# EAGLE schematic rizon-smd (EAGLE 8.4.1)
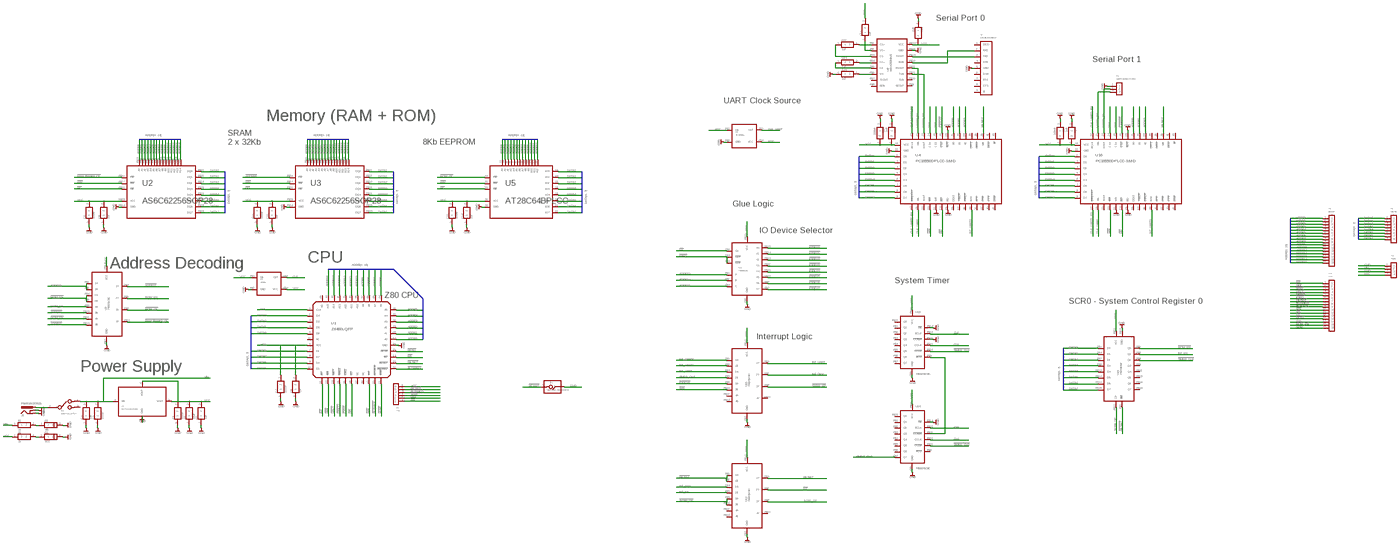
[diagram p0: schematic, sheet 1, overview]
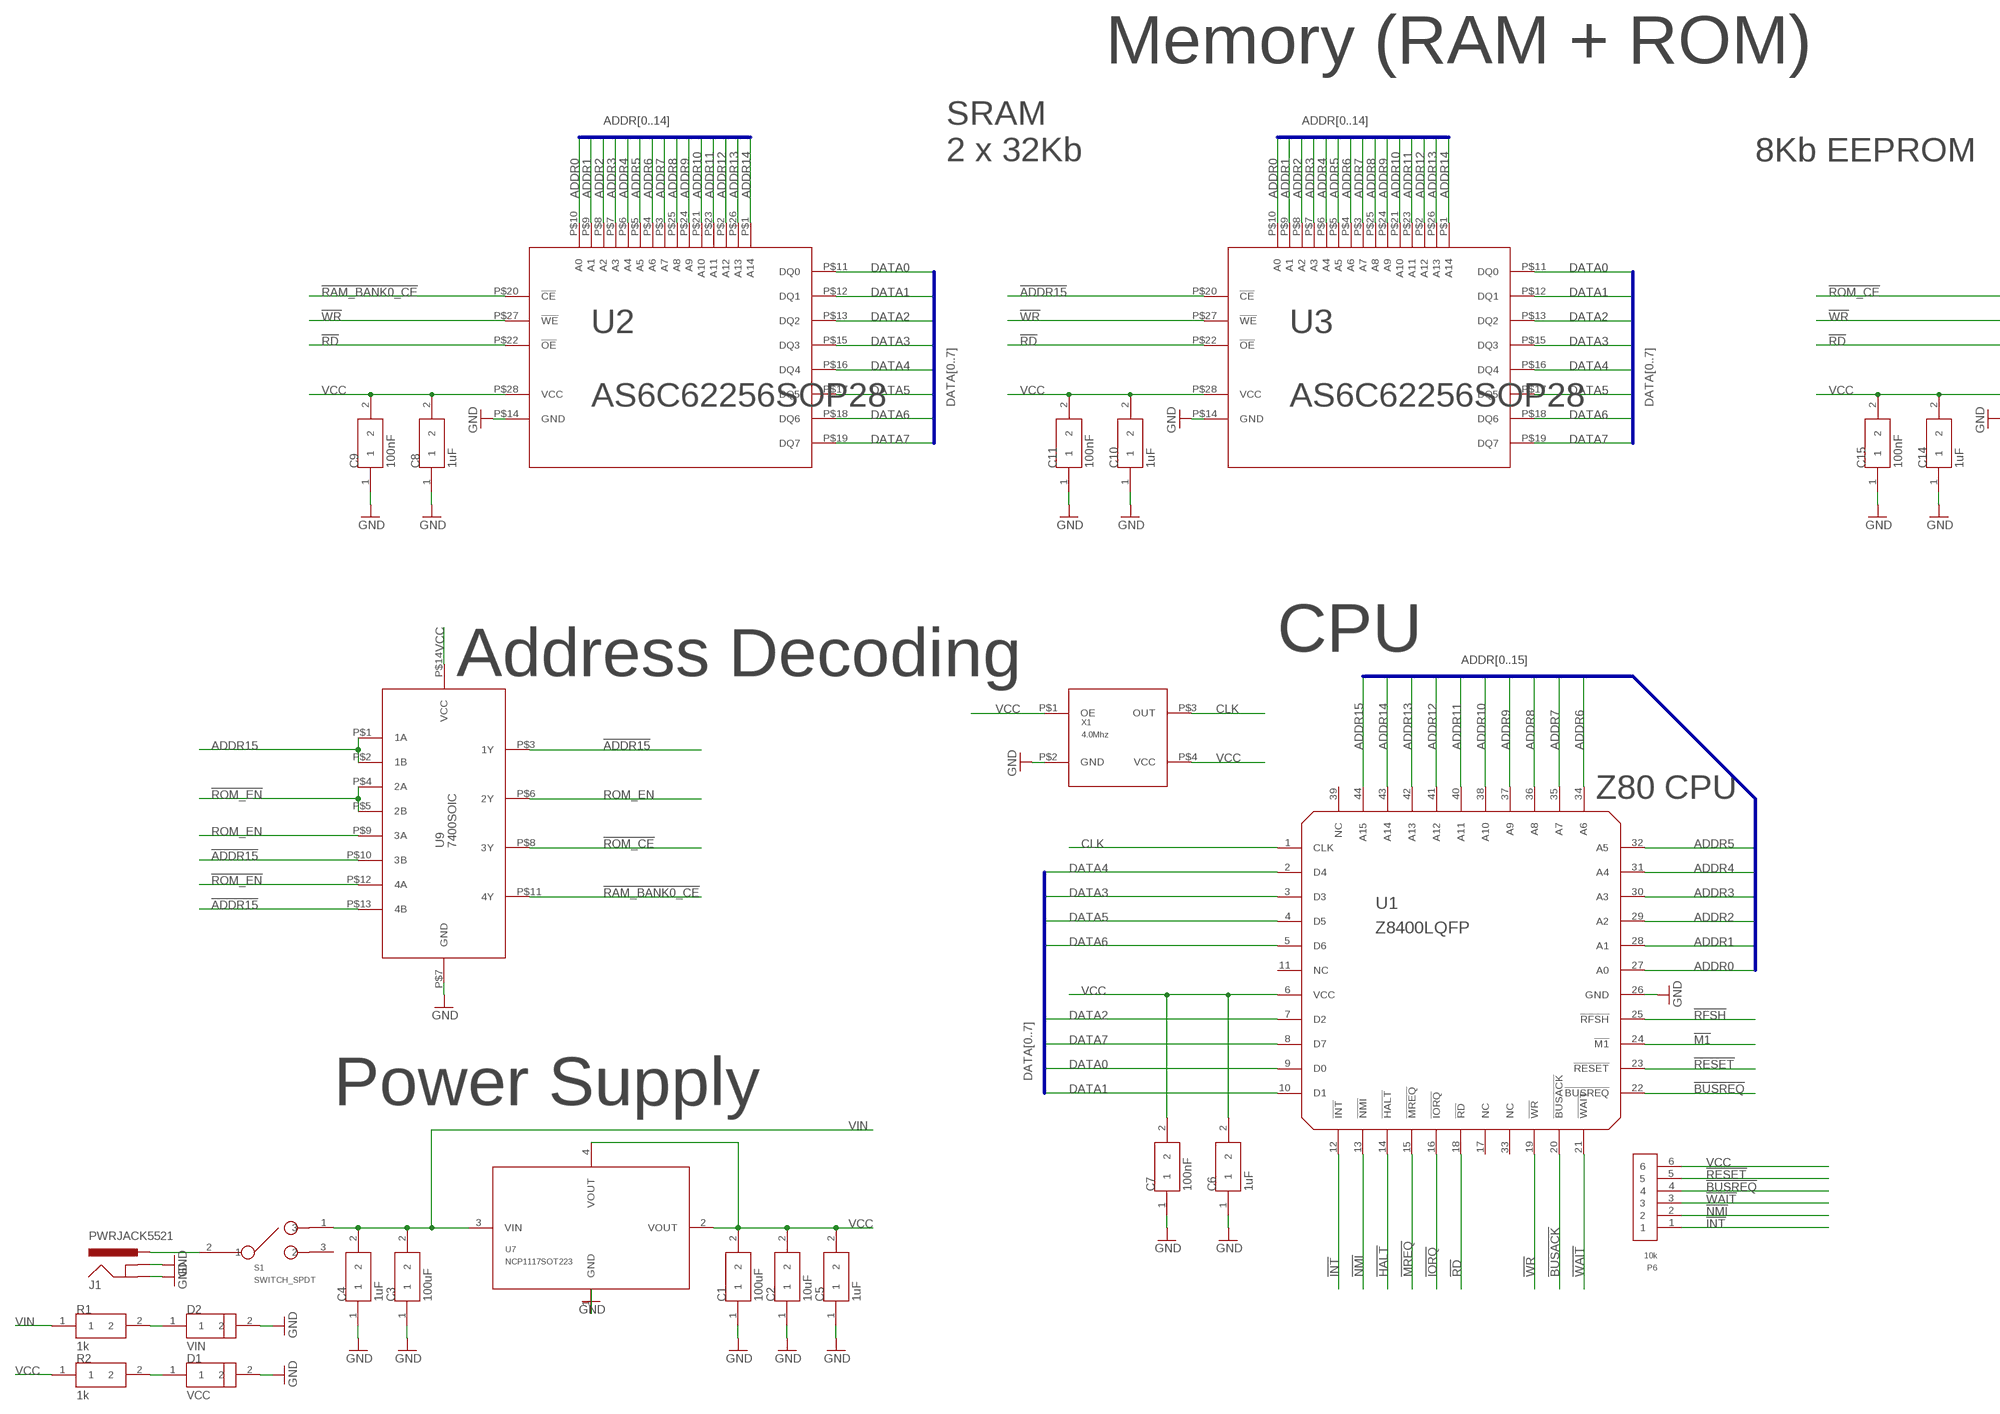
[diagram p1: schematic, sheet 1, part 1 of 4]
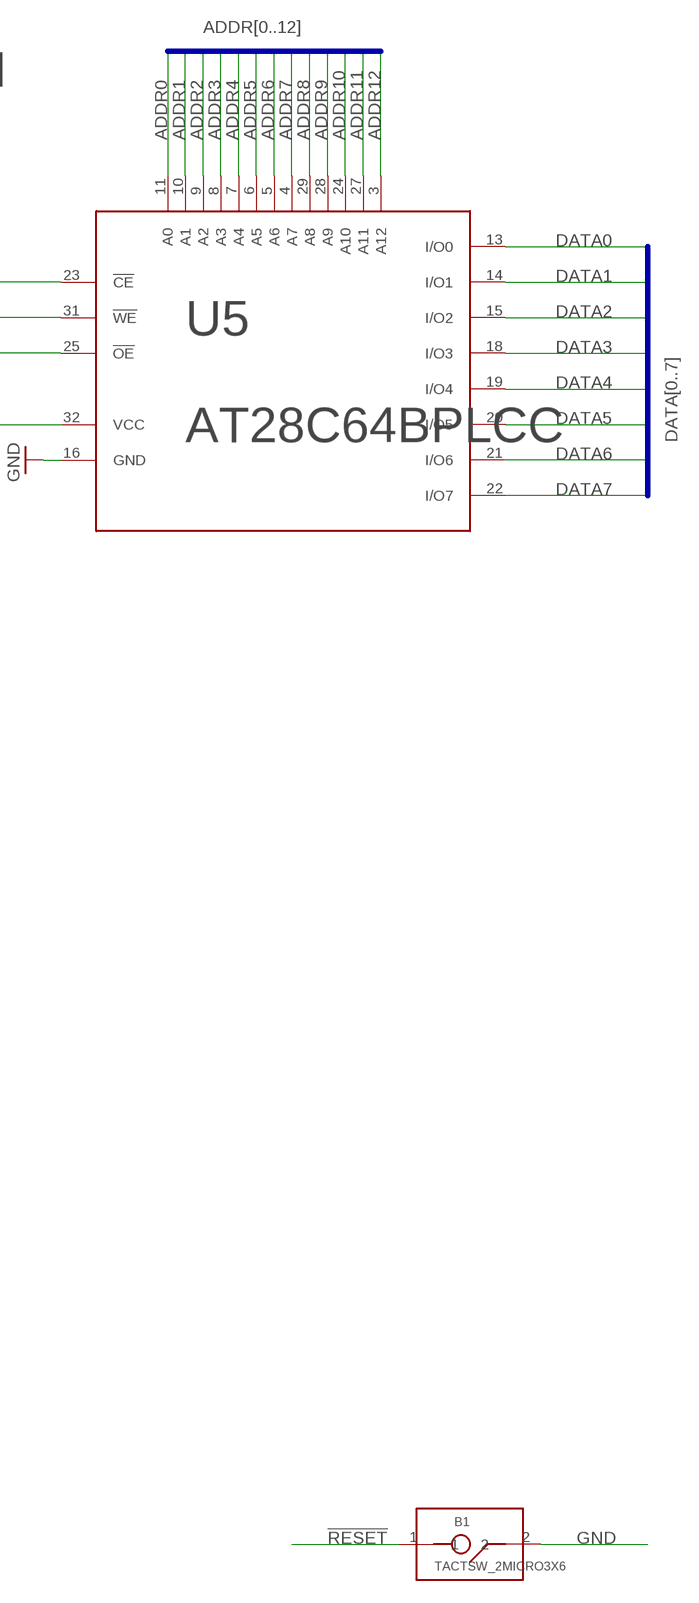
[diagram p2: schematic, sheet 1, part 2 of 4]
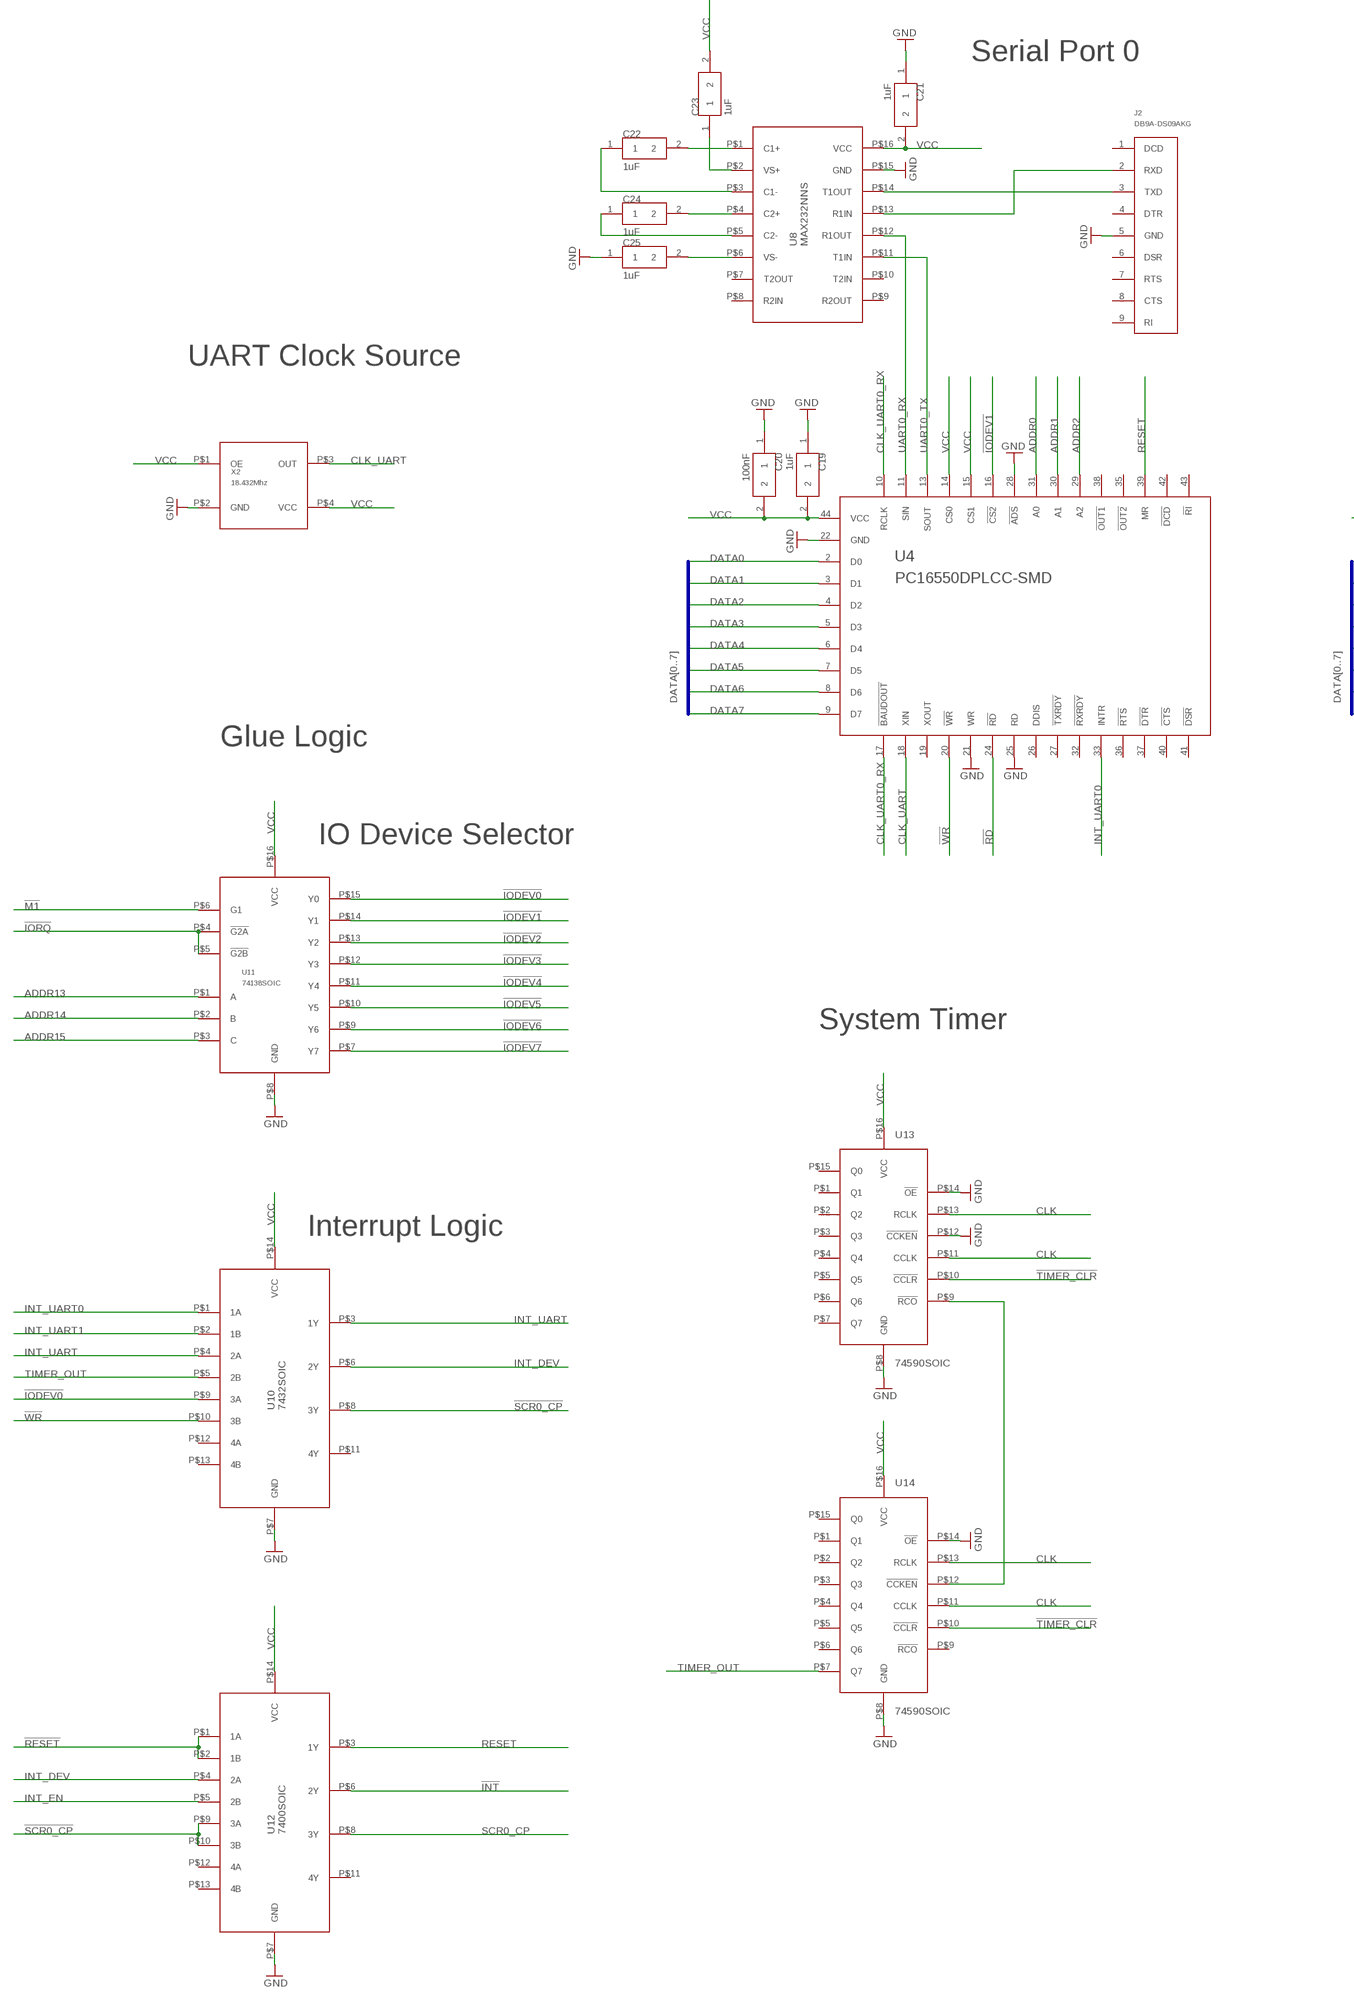
[diagram p3: schematic, sheet 1, part 3 of 4]
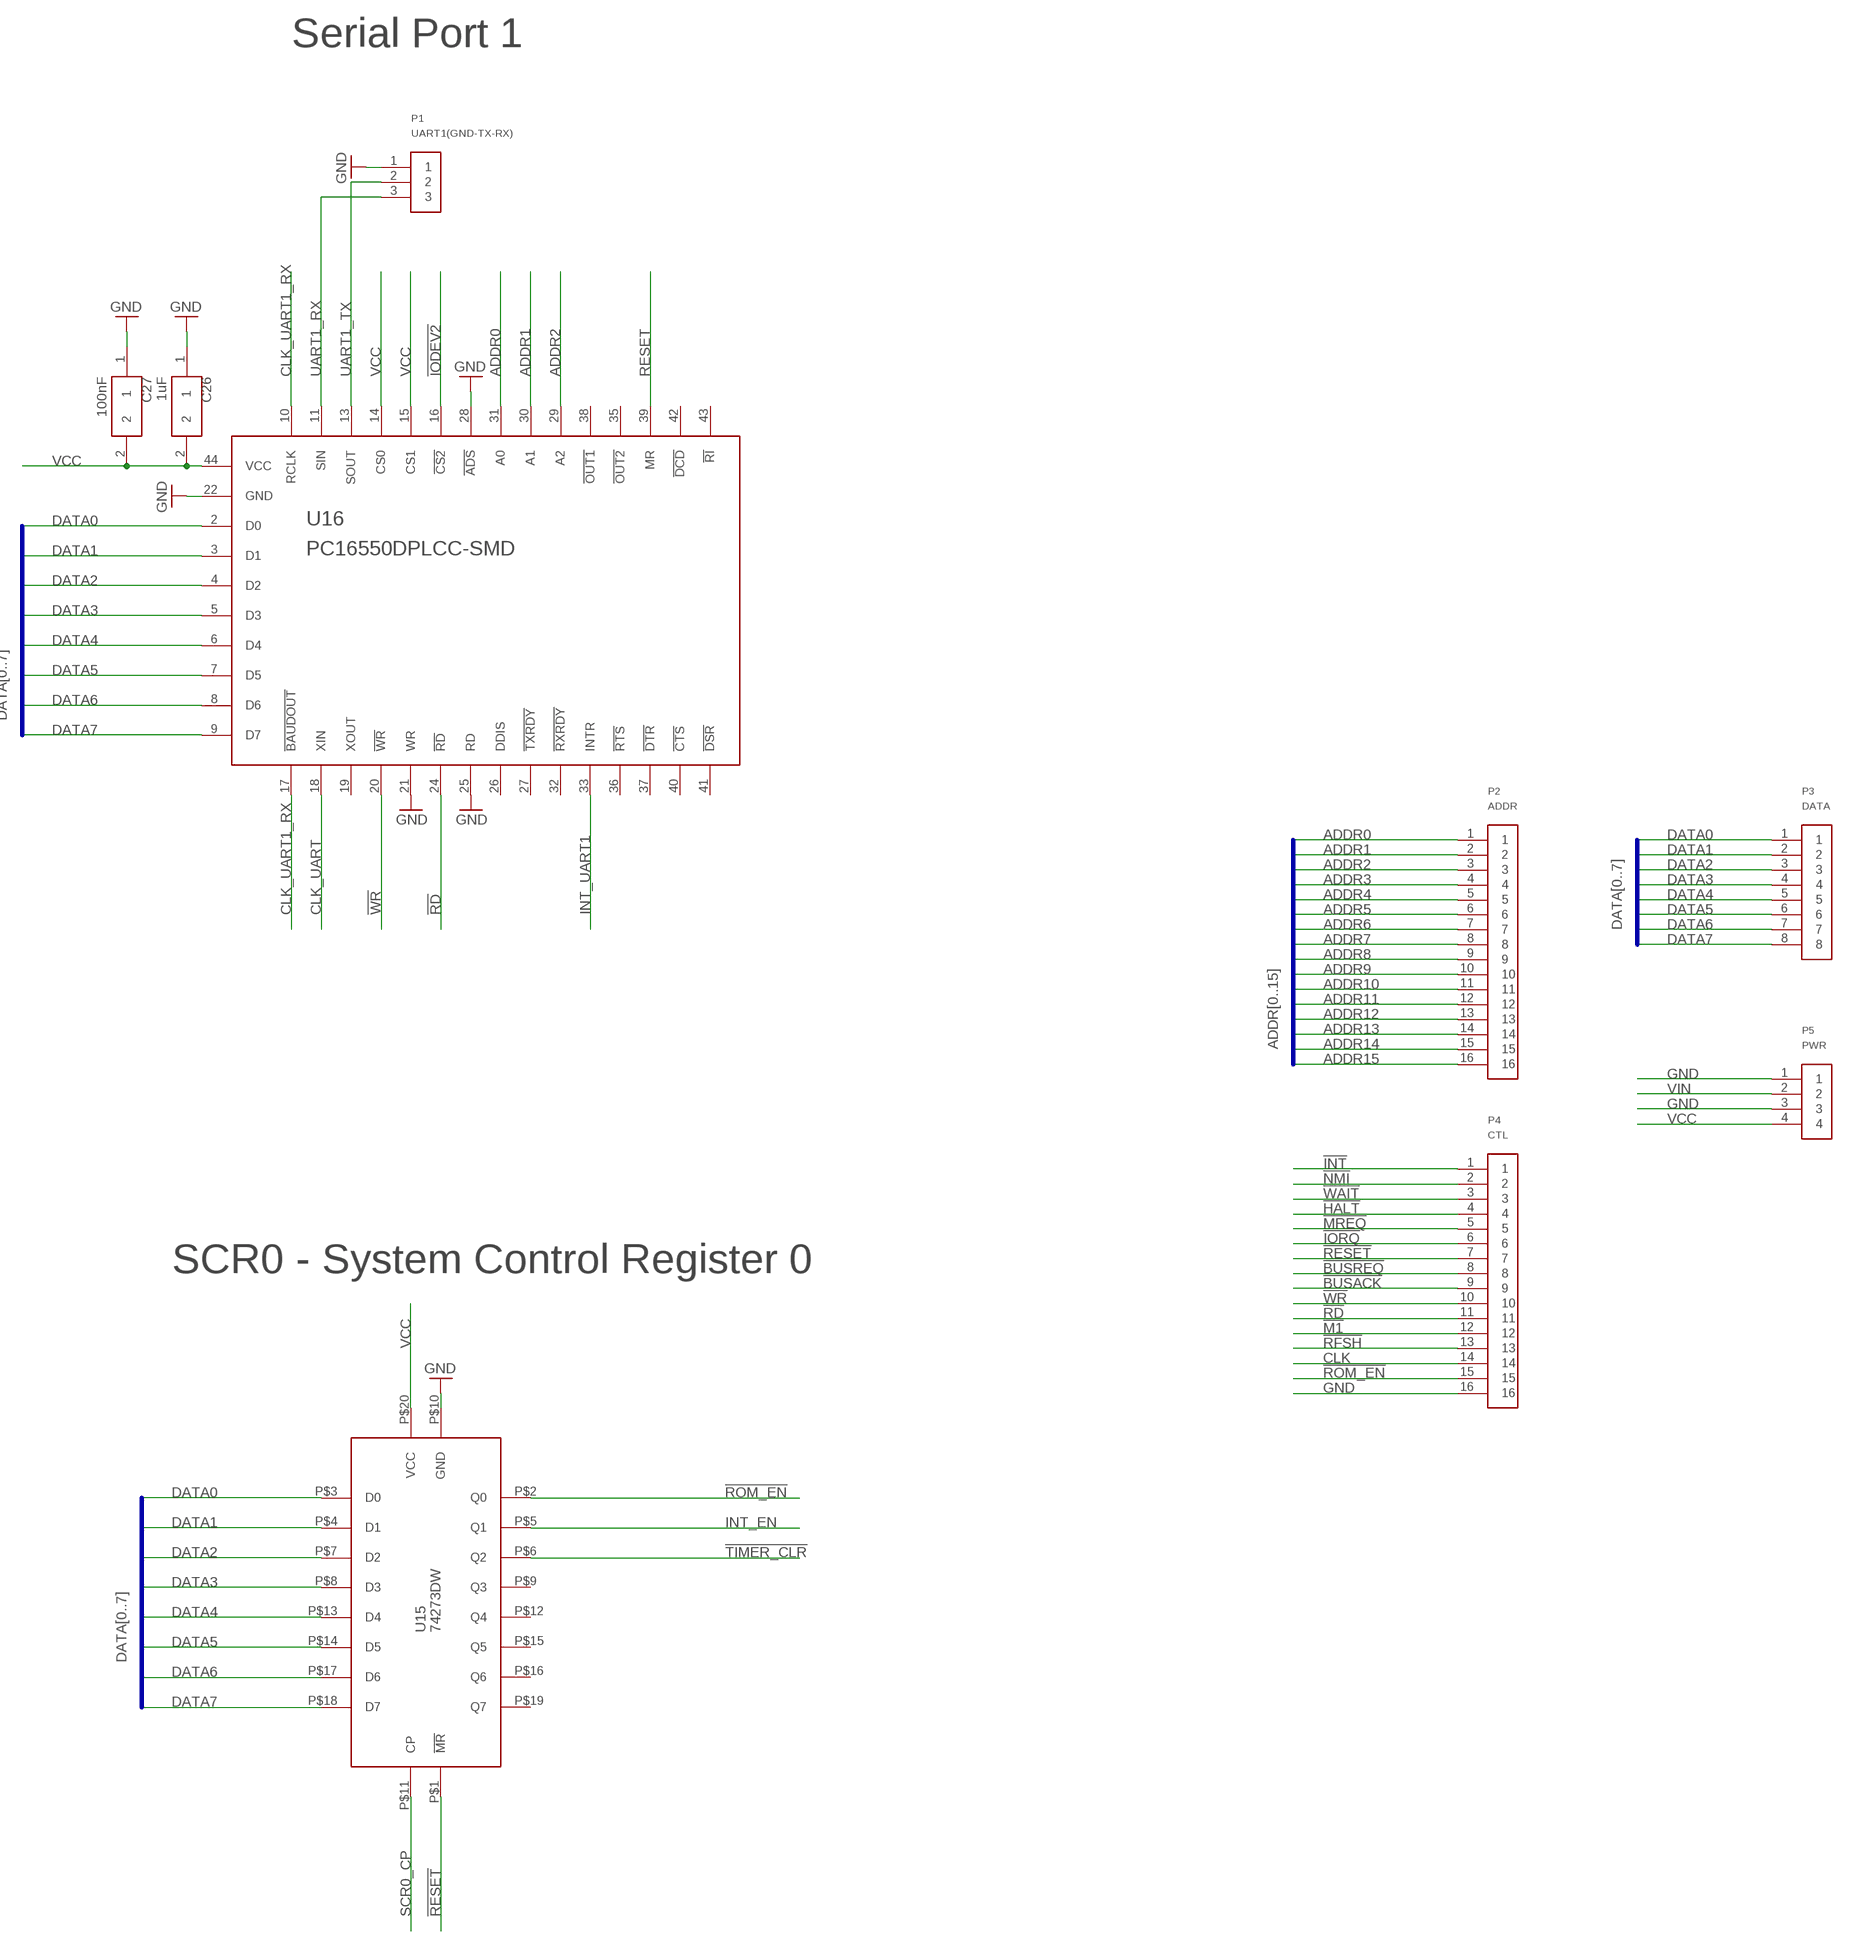
[diagram p4: schematic, sheet 1, part 4 of 4]

## Parts
B1  TACTSW_2MICRO3X6  [TACTSW_MICRO3X6]
C1  100uF  CAP1210  [1210]
C2  10uF  CAP0805  [0805]
C3  100uF  CAP1210  [1210]
C4  1uF  CAP0805  [0805]
C5  1uF  CAP0805  [0805]
C6  1uF  CAP0805  [0805]
C7  100nF  CAP0805  [0805]
C8  1uF  CAP0805  [0805]
C9  100nF  CAP0805  [0805]
C10  1uF  CAP0805  [0805]
C11  100nF  CAP0805  [0805]
C14  1uF  CAP0805  [0805]
C15  100nF  CAP0805  [0805]
C19  1uF  CAP0805  [0805]
C20  100nF  CAP0805  [0805]
C21  1uF  CAP0805  [0805]
C22  1uF  CAP0805  [0805]
C23  1uF  CAP0805  [0805]
C24  1uF  CAP0805  [0805]
C25  1uF  CAP0805  [0805]
C26  1uF  CAP0805  [0805]
C27  100nF  CAP0805  [0805]
D1  VCC  LED0805  [0805]
D2  VIN  LED0805  [0805]
J1  PWRJACK5521  [PWRJACK_5521]
J2  DB9A-DS09AKG  [A-DS09AKG]
P1  UART1(GND-TX-RX)  PIN_3  [PIN_3]
P2  ADDR  PIN_16  [PIN_16]
P3  DATA  PIN_8  [PIN_8]
P4  CTL  PIN_16  [PIN_16]
P5  PWR  PIN_4  [PIN_4]
P6  10k  PIN_61LINE  [PIN_6]
R1  1k  RES0805  [0805]
R2  1k  RES0805  [0805]
S1  SWITCH_SPDT  [JS102011]
U1  Z8400LQFP  [QFP44]
U2  AS6C62256SOP28  [SOP28]
U3  AS6C62256SOP28  [SOP28]
U4  PC16550DPLCC-SMD  [PLCC44]
U5  AT28C64BPLCC  [PLCC-S32--SOCKET]
U7  NCP1117SOT223  [SOT223]
U8  MAX232NNS  [SO16]
U9  7400SOIC  [SOIC14]
U10  7432SOIC  [SOIC14]
U11  74138SOIC  [SOIC16]
U12  7400SOIC  [SOIC14]
U13  74590SOIC  [SOIC16]
U14  74590SOIC  [SOIC16]
U15  74273DW  [SO20]
U16  PC16550DPLCC-SMD  [PLCC44]
X1  4.0Mhz  OSC4_OESMD-7X5  [OSC4-SMD-7X5]
X2  18.432Mhz  OSC4_OESMD-7X5  [OSC4-SMD-7X5]

## Nets
!ADDR15: U3.P$20(!CE) U9.P$3(1Y) U9.P$10(3B) U9.P$13(4B)
!BUSACK: P4.9 U1.20(!BUSACK)
!BUSREQ: P4.8 P6.4 U1.22(!BUSREQ)
!HALT: P4.4 U1.14(!HALT)
!INT: P4.1 P6.1 U1.12(!INT) U12.P$6(2Y)
!IODEV0: U10.P$9(3A) U11.P$15(Y0)
!IODEV1: U4.16(!CS2) U11.P$14(Y1)
!IODEV2: U11.P$13(Y2) U16.16(!CS2)
!IODEV3: U11.P$12(Y3)
!IODEV4: U11.P$11(Y4)
!IODEV5: U11.P$10(Y5)
!IODEV6: U11.P$9(Y6)
!IODEV7: U11.P$7(Y7)
!IORQ: P4.6 U1.16(!IORQ) U11.P$4(!G2A) U11.P$5(!G2B)
!M1: P4.12 U1.24(!M1) U11.P$6(G1)
!MREQ: P4.5 U1.15(!MREQ)
!NMI: P4.2 P6.2 U1.13(!NMI)
!RAM_BANK0_CE: U2.P$20(!CE) U9.P$11(4Y)
!RD: P4.11 U1.18(!RD) U2.P$22(!OE) U3.P$22(!OE) U4.24(!RD) U5.25(!OE) U16.24(!RD)
!RESET: B1.1 P4.7 P6.5 U1.23(!RESET) U12.P$1(1A) U12.P$2(1B) U15.P$1(!MR)
!RFSH: P4.13 U1.25(!RFSH)
!ROM_CE: U5.23(!CE) U9.P$8(3Y)
!ROM_EN: P4.15 U9.P$4(2A) U9.P$5(2B) U9.P$12(4A) U15.P$2(Q0)
!SCR0_CP: U10.P$8(3Y) U12.P$9(3A) U12.P$10(3B)
!TIMER_CLR: U13.P$10(!CCLR) U14.P$10(!CCLR) U15.P$6(Q2)
!WAIT: P4.3 P6.3 U1.21(!WAIT)
!WR: P4.10 U1.19(!WR) U2.P$27(!WE) U3.P$27(!WE) U4.20(!WR) U5.31(!WE) U10.P$10(3B) U16.20(!WR)
ADDR0: P2.1 U1.27(A0) U2.P$10(A0) U3.P$10(A0) U4.31(A0) U5.11(A0) U16.31(A0)
ADDR1: P2.2 U1.28(A1) U2.P$9(A1) U3.P$9(A1) U4.30(A1) U5.10(A1) U16.30(A1)
ADDR2: P2.3 U1.29(A2) U2.P$8(A2) U3.P$8(A2) U4.29(A2) U5.9(A2) U16.29(A2)
ADDR3: P2.4 U1.30(A3) U2.P$7(A3) U3.P$7(A3) U5.8(A3)
ADDR4: P2.5 U1.31(A4) U2.P$6(A4) U3.P$6(A4) U5.7(A4)
ADDR5: P2.6 U1.32(A5) U2.P$5(A5) U3.P$5(A5) U5.6(A5)
ADDR6: P2.7 U1.34(A6) U2.P$4(A6) U3.P$4(A6) U5.5(A6)
ADDR7: P2.8 U1.35(A7) U2.P$3(A7) U3.P$3(A7) U5.4(A7)
ADDR8: P2.9 U1.36(A8) U2.P$25(A8) U3.P$25(A8) U5.29(A8)
ADDR9: P2.10 U1.37(A9) U2.P$24(A9) U3.P$24(A9) U5.28(A9)
ADDR10: P2.11 U1.38(A10) U2.P$21(A10) U3.P$21(A10) U5.24(A10)
ADDR11: P2.12 U1.40(A11) U2.P$23(A11) U3.P$23(A11) U5.27(A11)
ADDR12: P2.13 U1.41(A12) U2.P$2(A12) U3.P$2(A12) U5.3(A12)
ADDR13: P2.14 U1.42(A13) U2.P$26(A13) U3.P$26(A13) U11.P$1(A)
ADDR14: P2.15 U1.43(A14) U2.P$1(A14) U3.P$1(A14) U11.P$2(B)
ADDR15: P2.16 U1.44(A15) U9.P$1(1A) U9.P$2(1B) U11.P$3(C)
CLK: P4.14 U1.1(CLK) U13.P$11(CCLK) U13.P$13(RCLK) U14.P$11(CCLK) U14.P$13(RCLK) X1.P$3(OUT)
CLK_UART: U4.18(XIN) U16.18(XIN) X2.P$3(OUT)
CLK_UART0_RX: U4.10(RCLK) U4.17(!BAUDOUT)
CLK_UART1_RX: U16.10(RCLK) U16.17(!BAUDOUT)
DATA0: P3.1 U1.9(D0) U2.P$11(DQ0) U3.P$11(DQ0) U4.2(D0) U5.13(I/O0) U15.P$3(D0) U16.2(D0)
DATA1: P3.2 U1.10(D1) U2.P$12(DQ1) U3.P$12(DQ1) U4.3(D1) U5.14(I/O1) U15.P$4(D1) U16.3(D1)
DATA2: P3.3 U1.7(D2) U2.P$13(DQ2) U3.P$13(DQ2) U4.4(D2) U5.15(I/O2) U15.P$7(D2) U16.4(D2)
DATA3: P3.4 U1.3(D3) U2.P$15(DQ3) U3.P$15(DQ3) U4.5(D3) U5.18(I/O3) U15.P$8(D3) U16.5(D3)
DATA4: P3.5 U1.2(D4) U2.P$16(DQ4) U3.P$16(DQ4) U4.6(D4) U5.19(I/O4) U15.P$13(D4) U16.6(D4)
DATA5: P3.6 U1.4(D5) U2.P$17(DQ5) U3.P$17(DQ5) U4.7(D5) U5.20(I/O5) U15.P$14(D5) U16.7(D5)
DATA6: P3.7 U1.5(D6) U2.P$18(DQ6) U3.P$18(DQ6) U4.8(D6) U5.21(I/O6) U15.P$17(D6) U16.8(D6)
DATA7: P3.8 U1.8(D7) U2.P$19(DQ7) U3.P$19(DQ7) U4.9(D7) U5.22(I/O7) U15.P$18(D7) U16.9(D7)
GND: B1.2 C1.1 C2.1 C3.1 C4.1 C5.1 C6.1 C7.1 C8.1 C9.1 C10.1 C11.1 C14.1 C15.1 C19.1 C20.1 C21.1 C25.1 C26.1 C27.1 D1.2 D2.2 J1.GND J1.GNDBREAK J2.5(GND) P1.1 P4.16 P5.1 P5.3 U1.26(GND) U2.P$14(GND) U3.P$14(GND) U4.21(WR) U4.22(GND) U4.25(RD) U4.28(!ADS) U5.16(GND) U7.1(GND) U8.P$15(GND) U9.P$7(GND) U10.P$7(GND) U11.P$8(GND) U12.P$7(GND) U13.P$8(GND) U13.P$12(!CCKEN) U13.P$14(!OE) U14.P$8(GND) U14.P$14(!OE) U15.P$10(GND) U16.21(WR) U16.22(GND) U16.25(RD) U16.28(!ADS) X1.P$2(GND) X2.P$2(GND)
INT_DEV: U10.P$6(2Y) U12.P$4(2A)
INT_EN: U12.P$5(2B) U15.P$5(Q1)
INT_UART: U10.P$3(1Y) U10.P$4(2A)
INT_UART0: U4.33(INTR) U10.P$1(1A)
INT_UART1: U10.P$2(1B) U16.33(INTR)
N$1: D2.1 R1.2
N$2: D1.1 R2.2
N$3: U13.P$9(!RCO) U14.P$12(!CCKEN)
N$4: J1.PWR S1.2
N$5: C24.2 U8.P$4(C2+)
N$6: C24.1 U8.P$5(C2-)
N$7: C22.1 U8.P$3(C1-)
N$8: C22.2 U8.P$1(C1+)
N$9: C23.1 U8.P$2(VS+)
N$10: C25.2 U8.P$6(VS-)
N$11: J2.3(TXD) U8.P$14(T1OUT)
N$12: J2.2(RXD) U8.P$13(R1IN)
RESET: U4.39(MR) U12.P$3(1Y) U16.39(MR)
ROM_EN: U9.P$6(2Y) U9.P$9(3A)
SCR0_CP: U12.P$8(3Y) U15.P$11(CP)
TIMER_OUT: U10.P$5(2B) U14.P$7(Q7)
UART0_RX: U4.11(SIN) U8.P$12(R1OUT)
UART0_TX: U4.13(SOUT) U8.P$11(T1IN)
UART1_RX: P1.3 U16.11(SIN)
UART1_TX: P1.2 U16.13(SOUT)
VCC: C1.2 C2.2 C5.2 C6.2 C7.2 C8.2 C9.2 C10.2 C11.2 C14.2 C15.2 C19.2 C20.2 C21.2 C23.2 C26.2 C27.2 P5.4 P6.6 R2.1 U1.6(VCC) U2.P$28(VCC) U3.P$28(VCC) U4.14(CS0) U4.15(CS1) U4.44(VCC) U5.32(VCC) U7.2(VOUT) U7.4(VOUT) U8.P$16(VCC) U9.P$14(VCC) U10.P$14(VCC) U11.P$16(VCC) U12.P$14(VCC) U13.P$16(VCC) U14.P$16(VCC) U15.P$20(VCC) U16.14(CS0) U16.15(CS1) U16.44(VCC) X1.P$1(OE) X1.P$4(VCC) X2.P$1(OE) X2.P$4(VCC)
VIN: C3.2 C4.2 P5.2 R1.1 S1.1 U7.3(VIN)
Unconnected: J2.1(DCD) J2.4(DTR) J2.6(DSR) J2.7(RTS) J2.8(CTS) J2.9(RI) S1.3 U1.11(NC) U1.17(NC) U1.33(NC) U1.39(NC) U4.19(XOUT) U4.26(DDIS) U4.27(!TXRDY) U4.32(!RXRDY) U4.35(!OUT2) U4.36(!RTS) U4.37(!DTR) U4.38(!OUT1) U4.40(!CTS) U4.41(!DSR) U4.42(!DCD) U4.43(!RI) U8.P$7(T2OUT) U8.P$8(R2IN) U8.P$9(R2OUT) U8.P$10(T2IN) U10.P$11(4Y) U10.P$12(4A) U10.P$13(4B) U12.P$11(4Y) U12.P$12(4A) U12.P$13(4B) U13.P$1(Q1) U13.P$2(Q2) U13.P$3(Q3) U13.P$4(Q4) U13.P$5(Q5) U13.P$6(Q6) U13.P$7(Q7) U13.P$15(Q0) U14.P$1(Q1) U14.P$2(Q2) U14.P$3(Q3) U14.P$4(Q4) U14.P$5(Q5) U14.P$6(Q6) U14.P$9(!RCO) U14.P$15(Q0) U15.P$9(Q3) U15.P$12(Q4) U15.P$15(Q5) U15.P$16(Q6) U15.P$19(Q7) U16.19(XOUT) U16.26(DDIS) U16.27(!TXRDY) U16.32(!RXRDY) U16.35(!OUT2) U16.36(!RTS) U16.37(!DTR) U16.38(!OUT1) U16.40(!CTS) U16.41(!DSR) U16.42(!DCD) U16.43(!RI)

## Buses
DATA[0..7]
ADDR[0..15]
ADDR[0..14]
ADDR[0..12]

## Notes on the sheet
- Serial Port 0
- Serial Port 1
- UART Clock Source
- Memory (RAM + ROM)
- SRAM
  2 x 32Kb
- 8Kb EEPROM
- Glue Logic
- IO Device Selector
- CPU
- Address Decoding
- System Timer
- Z80 CPU
- SCR0 - System Control Register 0
- Interrupt Logic
- Power Supply

## Library data of the parts
B1 = dooba:TACTSW_2
C1-C11 C14 C15 C19-C27 = dooba:CAP
D1 D2 = dooba:LED
J1 = dooba:PWRJACK
J2 = dooba:DB9
P1 = dooba:PIN_3
P2 P4 = dooba:PIN_16
P3 = dooba:PIN_8
P5 = dooba:PIN_4
P6 = dooba:PIN_6
R1 R2 = dooba:RES
S1 = dooba:SWITCH_SPDT
U1 = dooba:Z8400
U2 U3 = dooba:AS6C62256
U4 U16 = dooba:PC16550D
U5 = dooba:AT28C64B
U7 = dooba:NCP1117
U8 = dooba:MAX232N
U9 U12 = dooba:7400
U10 = dooba:7432
U11 = dooba:74138
U13 U14 = dooba:74590
U15 = dooba:74273
X1 X2 = dooba:OSC4_OE